# EAGLE design PGTN020_envelope (EAGLE 8.5.2)
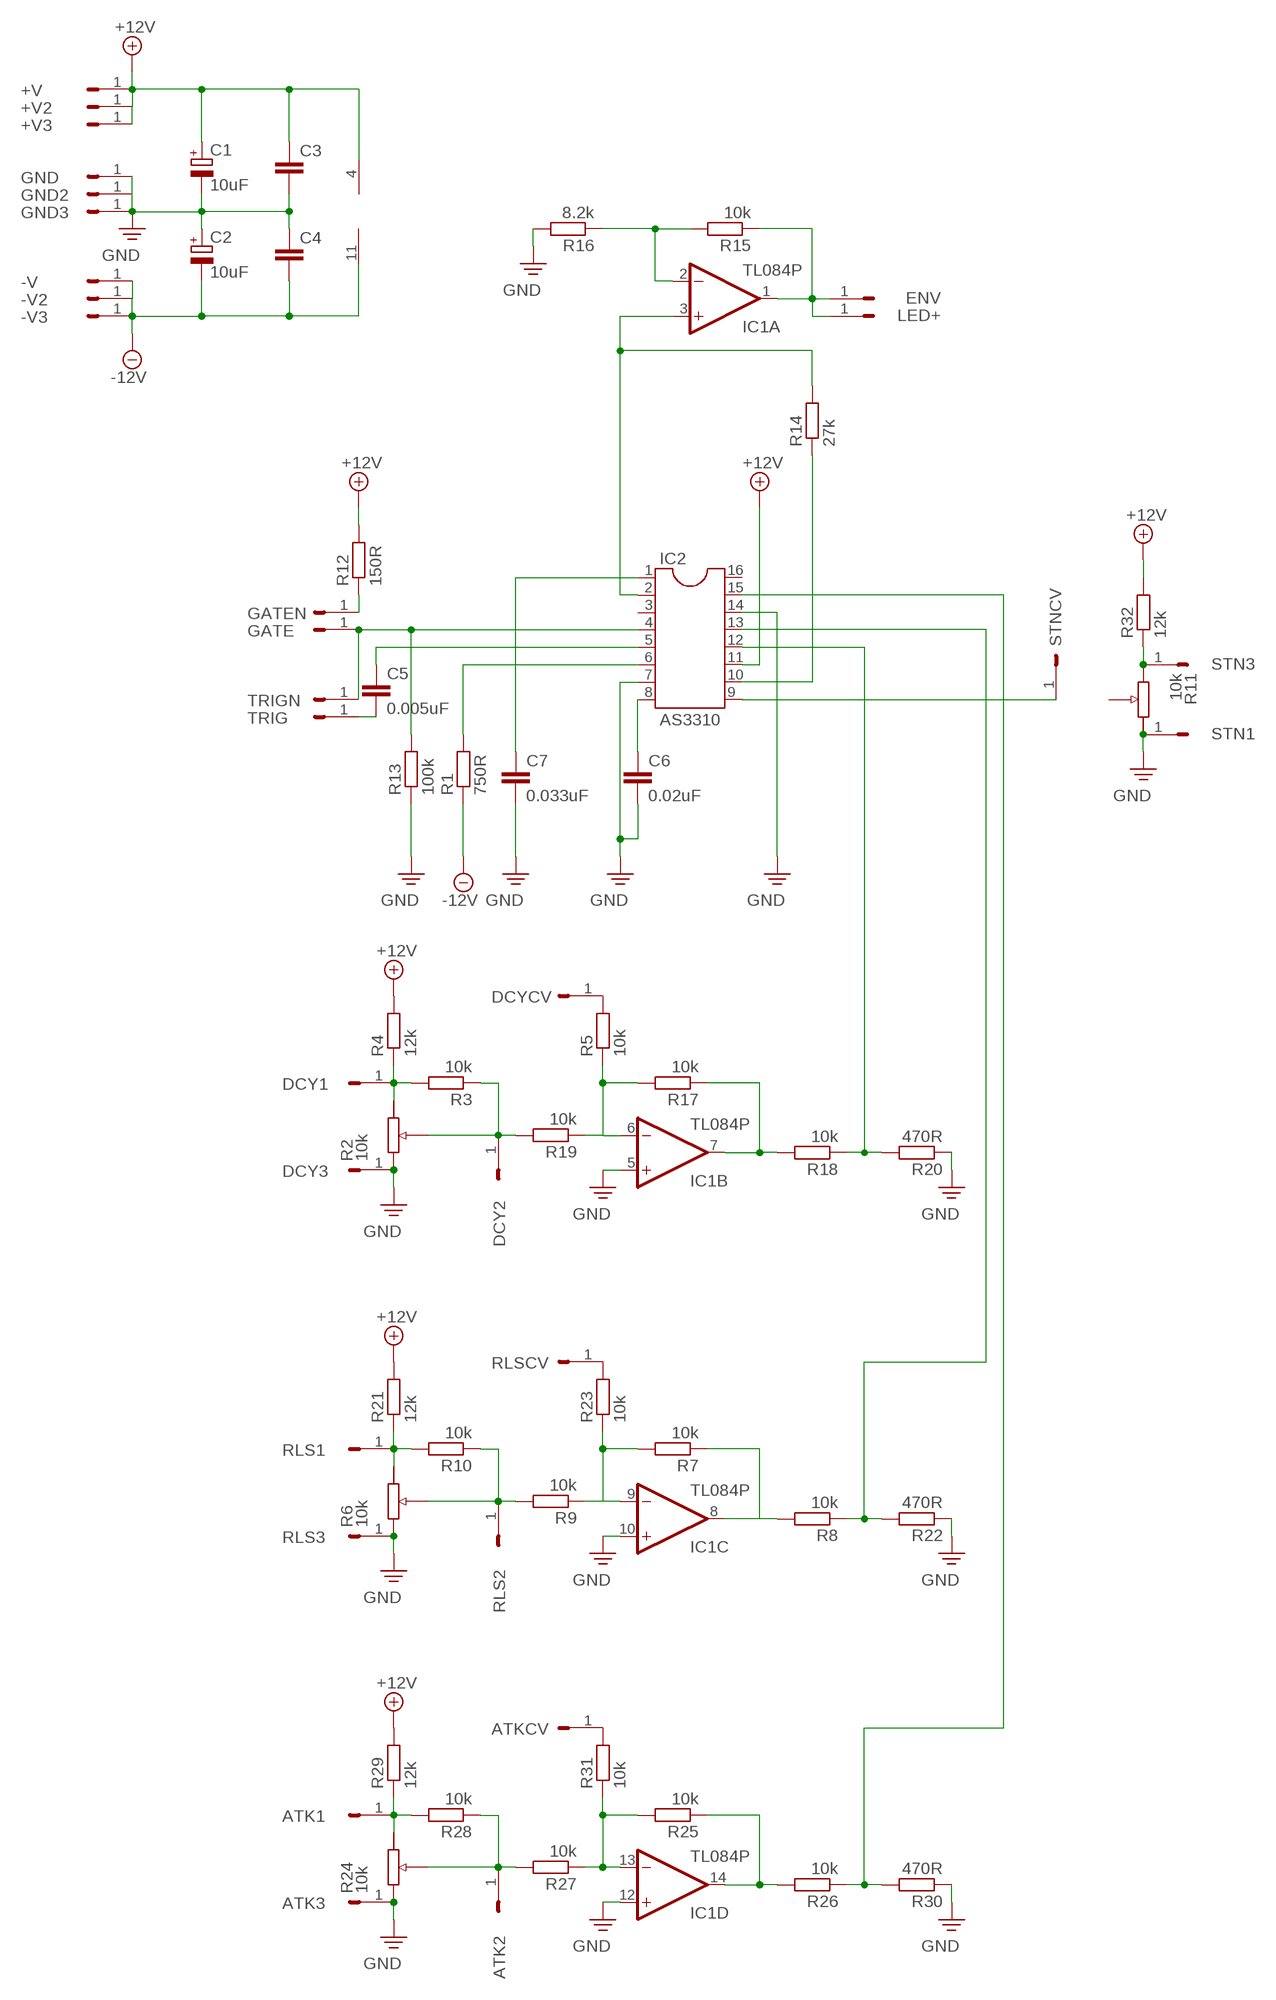
[diagram p0: schematic, sheet 1]

## Parts
+V  HEADER/MALE/01  [HEADER/MALE/01]
+V2  HEADER/MALE/01  [HEADER/MALE/01]
+V3  HEADER/MALE/01  [HEADER/MALE/01]
-V  HEADER/MALE/01  [HEADER/MALE/01]
-V2  HEADER/MALE/01  [HEADER/MALE/01]
-V3  HEADER/MALE/01  [HEADER/MALE/01]
ATK1  HEADER/MALE/01  [HEADER/MALE/01]
ATK2  HEADER/MALE/01  [HEADER/MALE/01]
ATK3  HEADER/MALE/01  [HEADER/MALE/01]
ATKCV  HEADER/MALE/01  [HEADER/MALE/01]
C1  10uF  CAPACITOR/POLARIZEDE2.5-6  [E2,5-6]
C2  10uF  CAPACITOR/POLARIZEDE2.5-6  [E2,5-6]
C3  CAPACITORCERAMICDISC/5  [CERAMICDISC/5]
C4  CAPACITORCERAMICDISC/5  [CERAMICDISC/5]
C5  0.005uF  CAPACITORCERAMICDISC/5  [CERAMICDISC/5]
C6  0.02uF  CAPACITORCERAMICDISC/5  [CERAMICDISC/5]
C7  0.033uF  CAPACITORCERAMICDISC/5  [CERAMICDISC/5]
DCY1  HEADER/MALE/01  [HEADER/MALE/01]
DCY2  HEADER/MALE/01  [HEADER/MALE/01]
DCY3  HEADER/MALE/01  [HEADER/MALE/01]
DCYCV  HEADER/MALE/01  [HEADER/MALE/01]
ENV  HEADER/MALE/01  [HEADER/MALE/01]
GATE  HEADER/MALE/01  [HEADER/MALE/01]
GATEN  HEADER/MALE/01  [HEADER/MALE/01]
GND  HEADER/MALE/01  [HEADER/MALE/01]
GND2  HEADER/MALE/01  [HEADER/MALE/01]
GND3  HEADER/MALE/01  [HEADER/MALE/01]
IC1  TL084P  [DIL14]
IC2  AS3310  DIL16  [DIL16]
LED+  HEADER/MALE/01  [HEADER/MALE/01]
R1  750R  RESISTORRESISTOR/UPRIGHT/7.5  [RESISTOR/7.5]
R2  10k  POTENTIOMETER  (no package)
R3  10k  RESISTORRESISTOR/UPRIGHT/7.5  [RESISTOR/7.5]
R4  12k  RESISTORRESISTOR/UPRIGHT/7.5  [RESISTOR/7.5]
R5  10k  RESISTORRESISTOR/UPRIGHT/7.5  [RESISTOR/7.5]
R6  10k  POTENTIOMETER  (no package)
R7  10k  RESISTORRESISTOR/UPRIGHT/7.5  [RESISTOR/7.5]
R8  10k  RESISTORRESISTOR/UPRIGHT/7.5  [RESISTOR/7.5]
R9  10k  RESISTORRESISTOR/UPRIGHT/7.5  [RESISTOR/7.5]
R10  10k  RESISTORRESISTOR/UPRIGHT/7.5  [RESISTOR/7.5]
R11  10k  POTENTIOMETER  (no package)
R12  150R  RESISTORRESISTOR/UPRIGHT/7.5  [RESISTOR/7.5]
R13  100k  RESISTORRESISTOR/UPRIGHT/7.5  [RESISTOR/7.5]
R14  27k  RESISTORRESISTOR/UPRIGHT/7.5  [RESISTOR/7.5]
R15  10k  RESISTORRESISTOR/UPRIGHT/7.5  [RESISTOR/7.5]
R16  8.2k  RESISTORRESISTOR/UPRIGHT/7.5  [RESISTOR/7.5]
R17  10k  RESISTORRESISTOR/UPRIGHT/7.5  [RESISTOR/7.5]
R18  10k  RESISTORRESISTOR/UPRIGHT/7.5  [RESISTOR/7.5]
R19  10k  RESISTORRESISTOR/UPRIGHT/7.5  [RESISTOR/7.5]
R20  470R  RESISTORRESISTOR/UPRIGHT/7.5  [RESISTOR/7.5]
R21  12k  RESISTORRESISTOR/UPRIGHT/7.5  [RESISTOR/7.5]
R22  470R  RESISTORRESISTOR/UPRIGHT/7.5  [RESISTOR/7.5]
R23  10k  RESISTORRESISTOR/UPRIGHT/7.5  [RESISTOR/7.5]
R24  10k  POTENTIOMETER  (no package)
R25  10k  RESISTORRESISTOR/UPRIGHT/7.5  [RESISTOR/7.5]
R26  10k  RESISTORRESISTOR/UPRIGHT/7.5  [RESISTOR/7.5]
R27  10k  RESISTORRESISTOR/UPRIGHT/7.5  [RESISTOR/7.5]
R28  10k  RESISTORRESISTOR/UPRIGHT/7.5  [RESISTOR/7.5]
R29  12k  RESISTORRESISTOR/UPRIGHT/7.5  [RESISTOR/7.5]
R30  470R  RESISTORRESISTOR/UPRIGHT/7.5  [RESISTOR/7.5]
R31  10k  RESISTORRESISTOR/UPRIGHT/7.5  [RESISTOR/7.5]
R32  12k  RESISTORRESISTOR/UPRIGHT/7.5  [RESISTOR/7.5]
RLS1  HEADER/MALE/01  [HEADER/MALE/01]
RLS2  HEADER/MALE/01  [HEADER/MALE/01]
RLS3  HEADER/MALE/01  [HEADER/MALE/01]
RLSCV  HEADER/MALE/01  [HEADER/MALE/01]
STN1  HEADER/MALE/01  [HEADER/MALE/01]
STN3  HEADER/MALE/01  [HEADER/MALE/01]
STNCV  HEADER/MALE/01  [HEADER/MALE/01]
TRIG  HEADER/MALE/01  [HEADER/MALE/01]
TRIGN  HEADER/MALE/01  [HEADER/MALE/01]

## Nets
+12V: +V2.1 +V3.1 +V.1 C1.+ C3.1 IC1.4(P:V+) IC2.11 R4.2 R12.2 R21.2 R29.2 R32.2
-12V: -V2.1 -V3.1 -V.1 C2.- C4.2 IC1.11(P:V-) R1.1
GND: ATK3.1 C1.- C2.+ C3.2 C4.1 C6.2 DCY3.1 GND2.1 GND3.1 GND.1 IC1.5(B:+IN) IC1.10(C:+IN) IC1.12(D:+IN) IC2.7 IC2.14 R2.E R6.E R11.A R13.1 R16.2 R20.1 R22.1 R24.E R30.1 RLS3.1 STN1.1
N$1: IC2.9 STNCV.1
N$2: GATEN.1 R12.1
N$3: C5.1 IC2.5
N$4: GATE.1 IC2.4 R13.2 TRIGN.1
N$5: DCYCV.1 R5.2
N$6: IC1.8(C:OUT) R7.1 R8.2
N$7: IC1.9(C:-IN) R7.2 R9.1 R23.1
N$8: R6.S R9.2 R10.1 RLS2.1
N$9: C5.2 TRIG.1
N$10: R6.A R10.2 R21.1 RLS1.1
N$11: IC2.13 R8.1 R22.2
N$12: IC2.6 R1.2
N$13: C6.1 IC2.8
N$14: C7.1 IC2.1
N$15: IC1.2(A:-IN) R15.2 R16.1
N$16: IC2.10 R14.1
N$17: IC1.3(A:+IN) IC2.2 R14.2
N$18: ENV.1 IC1.1(A:OUT) LED+.1 R15.1
N$19: IC1.7(B:OUT) R17.1 R18.2
N$20: IC1.6(B:-IN) R5.1 R17.2 R19.1
N$21: DCY2.1 R2.S R3.1 R19.2
N$22: IC2.12 R18.1 R20.2
N$23: DCY1.1 R2.A R3.2 R4.1
N$24: R23.2 RLSCV.1
N$25: IC1.14(D:OUT) R25.1 R26.2
N$26: IC1.13(D:-IN) R25.2 R27.1 R31.1
N$27: ATK2.1 R24.S R27.2 R28.1
N$28: ATK1.1 R24.A R28.2 R29.1
N$29: IC2.15 R26.1 R30.2
N$30: ATKCV.1 R31.2
N$31: R11.E R32.1 STN3.1
PE: C7.2 ; supply symbol labelled GND
Unconnected: IC2.3 IC2.16 R11.S

## Library data of the parts
+V +V2 +V3 -V -V2 -V3 ATK1-ATK3 ATKCV DCY1-DCY3 DCYCV ENV GATE GATEN GND GND2 GND3 LED+ RLS1-RLS3 RLSCV STN1 STN3 STNCV TRIG TRIGN = connectors:HEADER/MALE/01; SPICEPREFIX: X
C1 C2 = capacitors:CAPACITOR/POLARIZED: POLARIZED CAPACITOR, European symbol; SPICEPREFIX: C
C3-C7 = capacitors:CAPACITOR: CAPACITOR, European symbol
IC1 = ic_analogue:TL084: OP AMP
IC2 = ic_package:DIL16: Dual In Line / Socket
R1 R3-R5 R7-R10 R12-R23 R25-R32 = resistors:RESISTOR: RESISTOR, European symbol
R2 R6 R11 R24 = controls_off_brd:POTENTIOMETER: Trimm resistor; _EXTERNAL_: 1

## Board
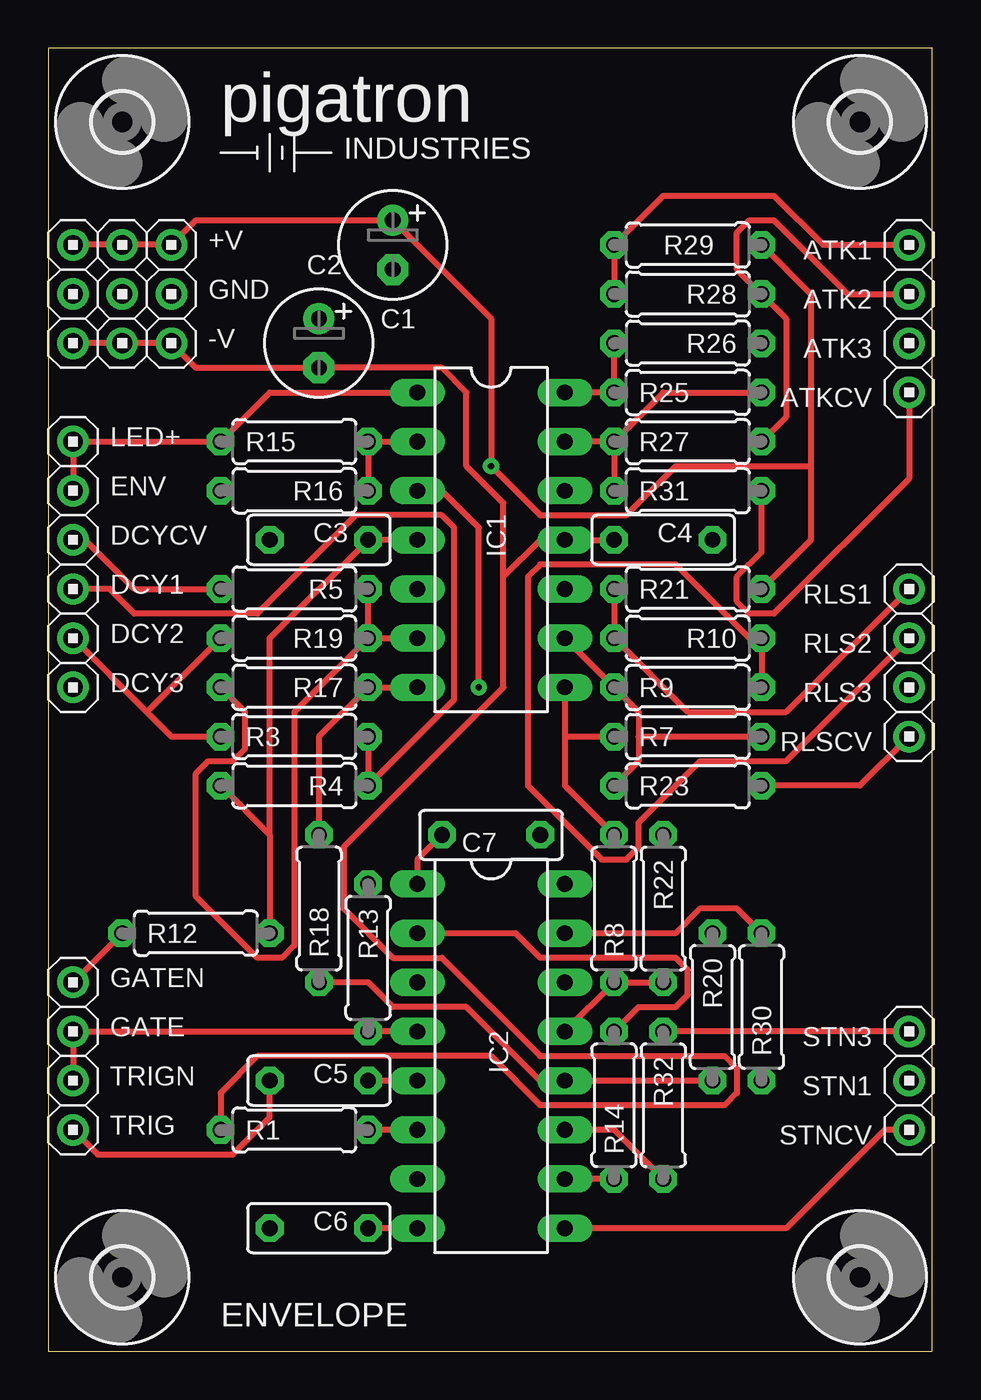
[diagram p1: board, top side]
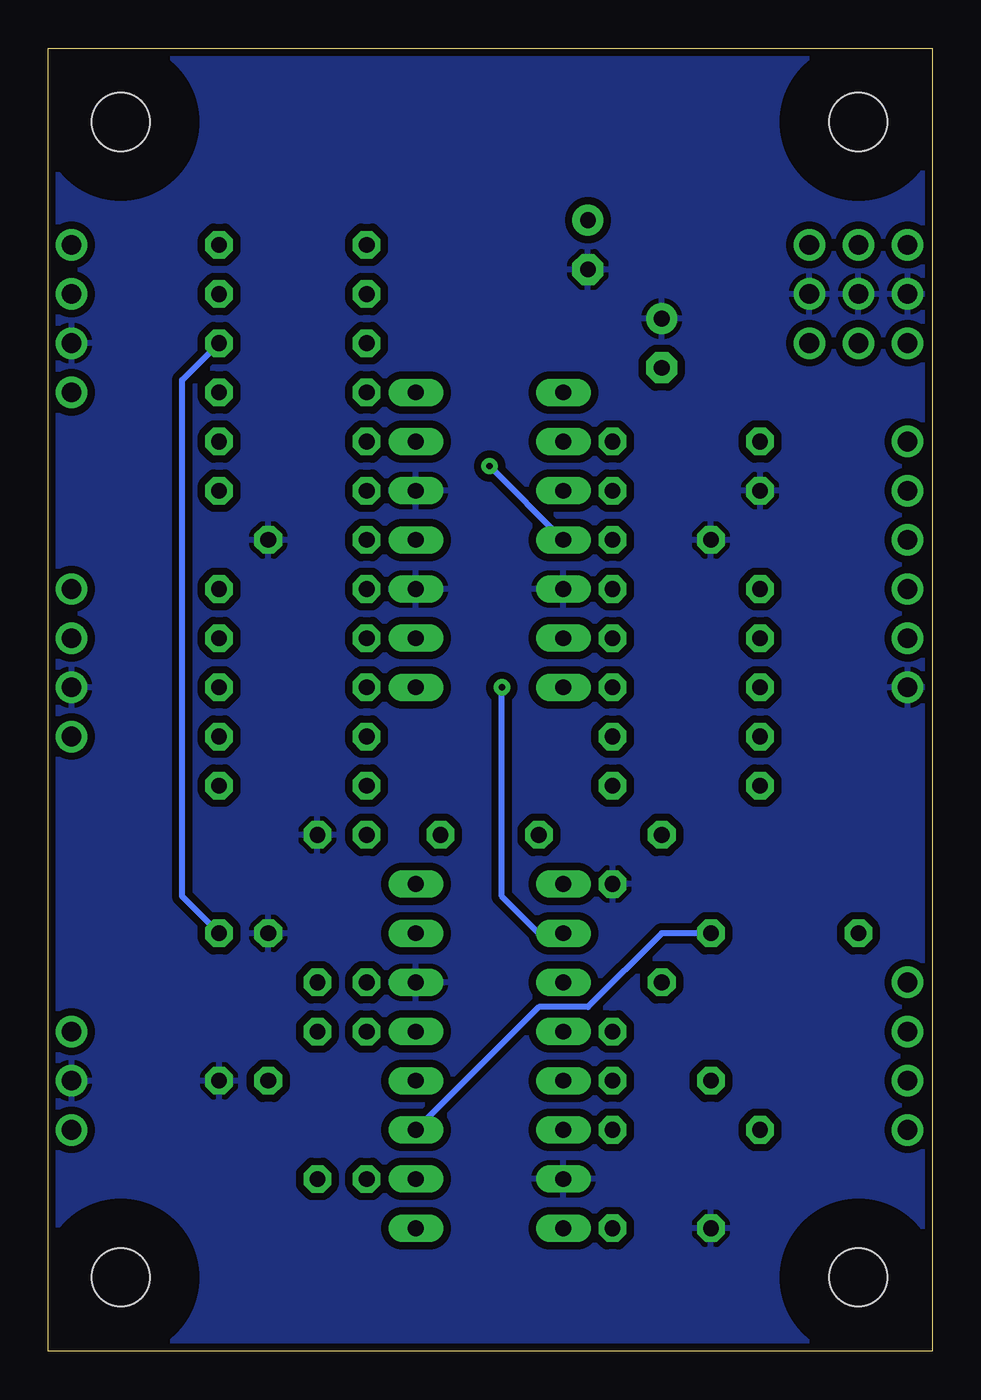
[diagram p2: board, bottom side, seen from below]

Size 45.64 x 67.3 mm. Coordinates in mm from the lower left corner, seen from the top.
Outline: 0,0 45.64,0 45.64,67.3 0,67.3 0,0
Copper layers (1*16): Top 0.0356mm / dielectric 1.5011mm / Bottom 0.0356mm
Design rules "pigatron": minimum track width 12mil, minimum drill 13mil, track to track 15mil, track to pad 10mil, pad to pad 10mil, via to via 10mil, smd to smd 6mil, copper to edge 15mil, drill to drill 10mil, minimum pad ring 12mil, minimum via ring 10mil, stop-mask expansion 4mil, vias tented up to drill 0mil, thermal gap 10mil

### Footprints (pad centres in the part's own frame; a part is rotated, then mirrored left to right if it is on the bottom)
HEADER/MALE/01 = drill 1.016: 1 0,0
E2,5-6 = drill 0.813 pad 1.6: + -1.27,0 | drill 0.813 pad 1.6 octagon: - 1.27,0
CERAMICDISC/5 = drill 0.813 octagon: 1 -2.54,0; 2 2.54,0
DIL14 = drill 0.813 long: 1 -7.62,-3.81; 2 -5.08,-3.81; 3 -2.54,-3.81; 4 0,-3.81; 5 2.54,-3.81; 6 5.08,-3.81; 7 7.62,-3.81; 8 7.62,3.81; 9 5.08,3.81; 10 2.54,3.81; 11 0,3.81; 12 -2.54,3.81; 13 -5.08,3.81; 14 -7.62,3.81
DIL16 = drill 0.813 long: 1 -8.89,-3.81; 2 -6.35,-3.81; 3 -3.81,-3.81; 4 -1.27,-3.81; 5 1.27,-3.81; 6 3.81,-3.81; 7 6.35,-3.81; 8 8.89,-3.81; 9 8.89,3.81; 10 6.35,3.81; 11 3.81,3.81; 12 1.27,3.81; 13 -1.27,3.81; 14 -3.81,3.81; 15 -6.35,3.81; 16 -8.89,3.81
RESISTOR/7.5 = drill 0.813 octagon: 1 -3.81,0; 2 3.81,0
STANDOFF/3.0 = hole 3: 0,0

### Placement (x,y rotation side)
+V  6.35,57.15 0 top
+V2  3.81,57.15 0 top
+V3  1.27,57.15 0 top
-V  6.35,52.07 0 top
-V2  3.81,52.07 0 top
-V3  1.27,52.07 0 top
ATK1  44.45,57.15 180 top
ATK2  44.45,54.61 180 top
ATK3  44.45,52.07 180 top
ATKCV  44.45,49.53 180 top
C1  17.78,57.15 270 top
C2  13.97,52.07 270 top
C3  13.97,41.91 180 top
C4  31.75,41.91 180 top
C5  13.97,13.97 180 top
C6  13.97,6.35 180 top
C7  22.86,26.67 0 top
DCY1  1.27,39.37 0 top
DCY2  1.27,36.83 0 top
DCY3  1.27,34.29 0 top
DCYCV  1.27,41.91 0 top
ENV  1.27,44.45 0 top
GATE  1.27,16.51 0 top
GATEN  1.27,19.05 0 top
GND  6.35,54.61 0 top
GND2  1.27,54.61 0 top
GND3  3.81,54.61 0 top
IC1  22.86,41.91 270 top
IC2  22.86,15.24 270 top
LED+  1.27,46.99 0 top
R1  12.7,11.43 0 top
R3  12.7,31.75 0 top
R4  12.7,29.21 180 top
R5  12.7,39.37 180 top
R7  33.02,31.75 0 top
R8  29.21,22.86 90 top
R9  33.02,34.29 0 top
R10  33.02,36.83 180 top
R12  7.62,21.59 0 top
R13  16.51,20.32 270 top
R14  29.21,12.7 90 top
R15  12.7,46.99 0 top
R16  12.7,44.45 180 top
R17  12.7,34.29 180 top
R18  13.97,22.86 90 top
R19  12.7,36.83 180 top
R20  34.29,17.78 270 top
R21  33.02,39.37 0 top
R22  31.75,22.86 270 top
R23  33.02,29.21 0 top
R25  33.02,49.53 0 top
R26  33.02,52.07 180 top
R27  33.02,46.99 0 top
R28  33.02,54.61 180 top
R29  33.02,57.15 0 top
R30  36.83,17.78 90 top
R31  33.02,44.45 0 top
R32  31.75,12.7 270 top
RLS1  44.45,39.37 180 top
RLS2  44.45,36.83 180 top
RLS3  44.45,34.29 180 top
RLSCV  44.45,31.75 180 top
STN1  44.45,13.97 180 top
STN3  44.45,16.51 180 top
STNCV  44.45,11.43 180 top
TRIG  1.27,11.43 0 top
TRIGN  1.27,13.97 0 top
U$1  [STANDOFF/3.0]  3.81,3.81 0 top
U$2  [STANDOFF/3.0]  41.91,3.81 0 top
U$3  [STANDOFF/3.0]  3.81,63.5 0 top
U$4  [STANDOFF/3.0]  41.91,63.5 0 top
U$5  [PIGATRON-LOGO]  17.78,63.5 0 top

### Tracks (layer width: path | path; a pad name or v marks a point on that pad's centre or on a via)
+12V  (via drill 0.33)
  Top 0.305: IC2.11 29.21,11.43 R32.2 | 11.43,26.67 R12.2 | R4.2 11.43,26.67 | 11.43,26.67 11.43,36.83 C3.1 IC1.4 | R21.2 39.37,41.91 39.37,45.72 | 39.37,45.72 39.37,54.61 R29.2 | +V3.1 +V2.1 +V.1 7.62,58.42 C1.+ 22.86,53.34 v22.86,45.72 25.4,43.18 29.84,43.18 32.38,45.72 39.37,45.72
  Bottom 0.305: IC2.11 20.32,17.78 17.78,17.78 13.97,21.59 R12.2 | IC1.4 v22.86,45.72
-12V
  Top 0.305: -V3.1 -V2.1 -V.1 7.62,50.8 C2.- 20.32,50.8 21.59,49.53 21.59,45.72 23.5,43.81 23.5,40.01 | R1.1 8.89,13.34 10.79,15.24 22.86,15.24 25.4,12.7 34.92,12.7 35.56,13.34 35.56,14.61 34.92,15.24 25.4,15.24 20.32,20.32 17.78,20.32 15.24,22.86 15.24,26.04 23.5,34.29 23.5,40.01 | 23.5,40.01 25.4,41.91 IC1.11 C4.2
GND
  pour Bottom: 0,67.31 0,0 45.72,0 45.72,67.31
N$1
  Top 0.305: IC2.9 38.1,6.35 43.18,11.43 STNCV.1
N$2
  Top 0.305: GATEN.1 R12.1
N$3
  Top 0.305: IC2.5 C5.1
N$4
  Top 0.305: IC2.4 R13.2 GATE.1 TRIGN.1
N$5
  Top 0.305: R5.2 4.45,39.37 1.91,41.91 DCYCV.1
N$6
  Top 0.305: R8.2 26.67,29.21 26.67,31.75 | IC1.8 26.67,31.75 | 26.67,31.75 R7.1
N$7
  Top 0.305: R23.1 30.48,30.48 30.48,31.75 | 30.48,31.75 30.48,33.02 R9.1 IC1.9 | 30.48,31.75 R7.2
N$8
  Top 0.305: 36.83,36.2 R9.2 | RLS2.1 38.1,30.48 33.66,30.48 30.48,27.3 30.48,26.04 29.84,25.4 28.57,25.4 24.77,29.21 24.77,40.01 25.4,40.64 32.38,40.64 36.83,36.2 | 36.83,36.2 R10.1
N$9
  Top 0.305: C5.2 11.43,12.06 9.53,10.16 2.54,10.16 TRIG.1
N$10
  Top 0.305: R21.1 R10.2 33.02,33.02 38.1,33.02 RLS1.1
N$11
  Top 0.305: IC2.13 R8.1 R22.2
N$12
  Top 0.305: IC2.6 R1.2
N$13
  Top 0.305: IC2.8 C6.1
N$14
  Top 0.305: IC2.1 19.05,25.4 C7.1
N$15
  Top 0.305: R16.1 R15.2 IC1.2
N$16
  Top 0.305: R14.1 IC2.10
N$17  (via drill 0.33)
  Top 0.305: IC2.2 24.13,21.59 25.4,20.32 32.38,20.32 33.02,19.68 33.02,18.41 32.38,17.78 30.48,17.78 R14.2 | IC1.3 20.32,44.45 22.23,42.55 v22.23,34.29
  Bottom 0.305: v22.23,34.29 22.23,23.5 20.32,21.59 IC2.2
N$18
  Top 0.305: IC1.1 11.43,49.53 R15.1 LED+.1 ENV.1
N$19
  Top 0.305: R18.2 13.97,31.75 R17.1 IC1.7
N$20
  Top 0.305: R17.2 10.16,33.02 10.16,31.11 9.53,30.48 8.26,30.48 7.62,29.84 7.62,23.5 10.79,20.32 12.06,20.32 12.7,20.95 12.7,33.02 R19.1 | R19.1 IC1.6 | R19.1 R5.1
N$21
  Top 0.305: R3.1 6.35,31.75 5.08,33.02 | DCY2.1 5.08,33.02 | 5.08,33.02 R19.2
N$22
  Top 0.305: R20.2 IC2.12 25.4,13.97 21.59,17.78 17.78,17.78 16.51,19.05 R18.1
N$23
  Top 0.305: R3.2 R4.1 20.95,33.66 20.95,42.55 20.32,43.18 15.88,43.18 10.79,38.1 4.45,38.1 3.17,39.37 DCY1.1
N$24
  Top 0.305: R23.2 41.91,29.21 RLSCV.1
N$25
  Top 0.305: IC1.14 R25.1 R26.2
N$26
  Top 0.305: R27.1 IC1.13 | R27.1 R31.1 | R25.2 31.75,49.53 R27.1
N$27
  Top 0.305: R27.2 38.1,48.26 38.1,53.34 R28.1 35.56,55.88 35.56,57.78 36.2,58.42 37.47,58.42 41.27,54.61 ATK2.1
N$28
  Top 0.305: R28.2 R29.1 31.75,59.69 37.47,59.69 40.01,57.15 ATK1.1
N$29
  Top 0.305: IC2.15 32.38,21.59 33.66,22.86 35.56,22.86 R30.2
  Bottom 0.305: R26.1 38.73,50.16 38.73,23.5 R30.2
N$30
  Top 0.305: R31.2 36.83,41.27 35.56,40.01 35.56,38.73 36.2,38.1 37.47,38.1 44.45,45.09 ATKCV.1
N$31
  Top 0.305: STN3.1 R32.1

### Text on the board
tNames: ENVELOPE